# EAGLE design CatNip (EAGLE 5.11)
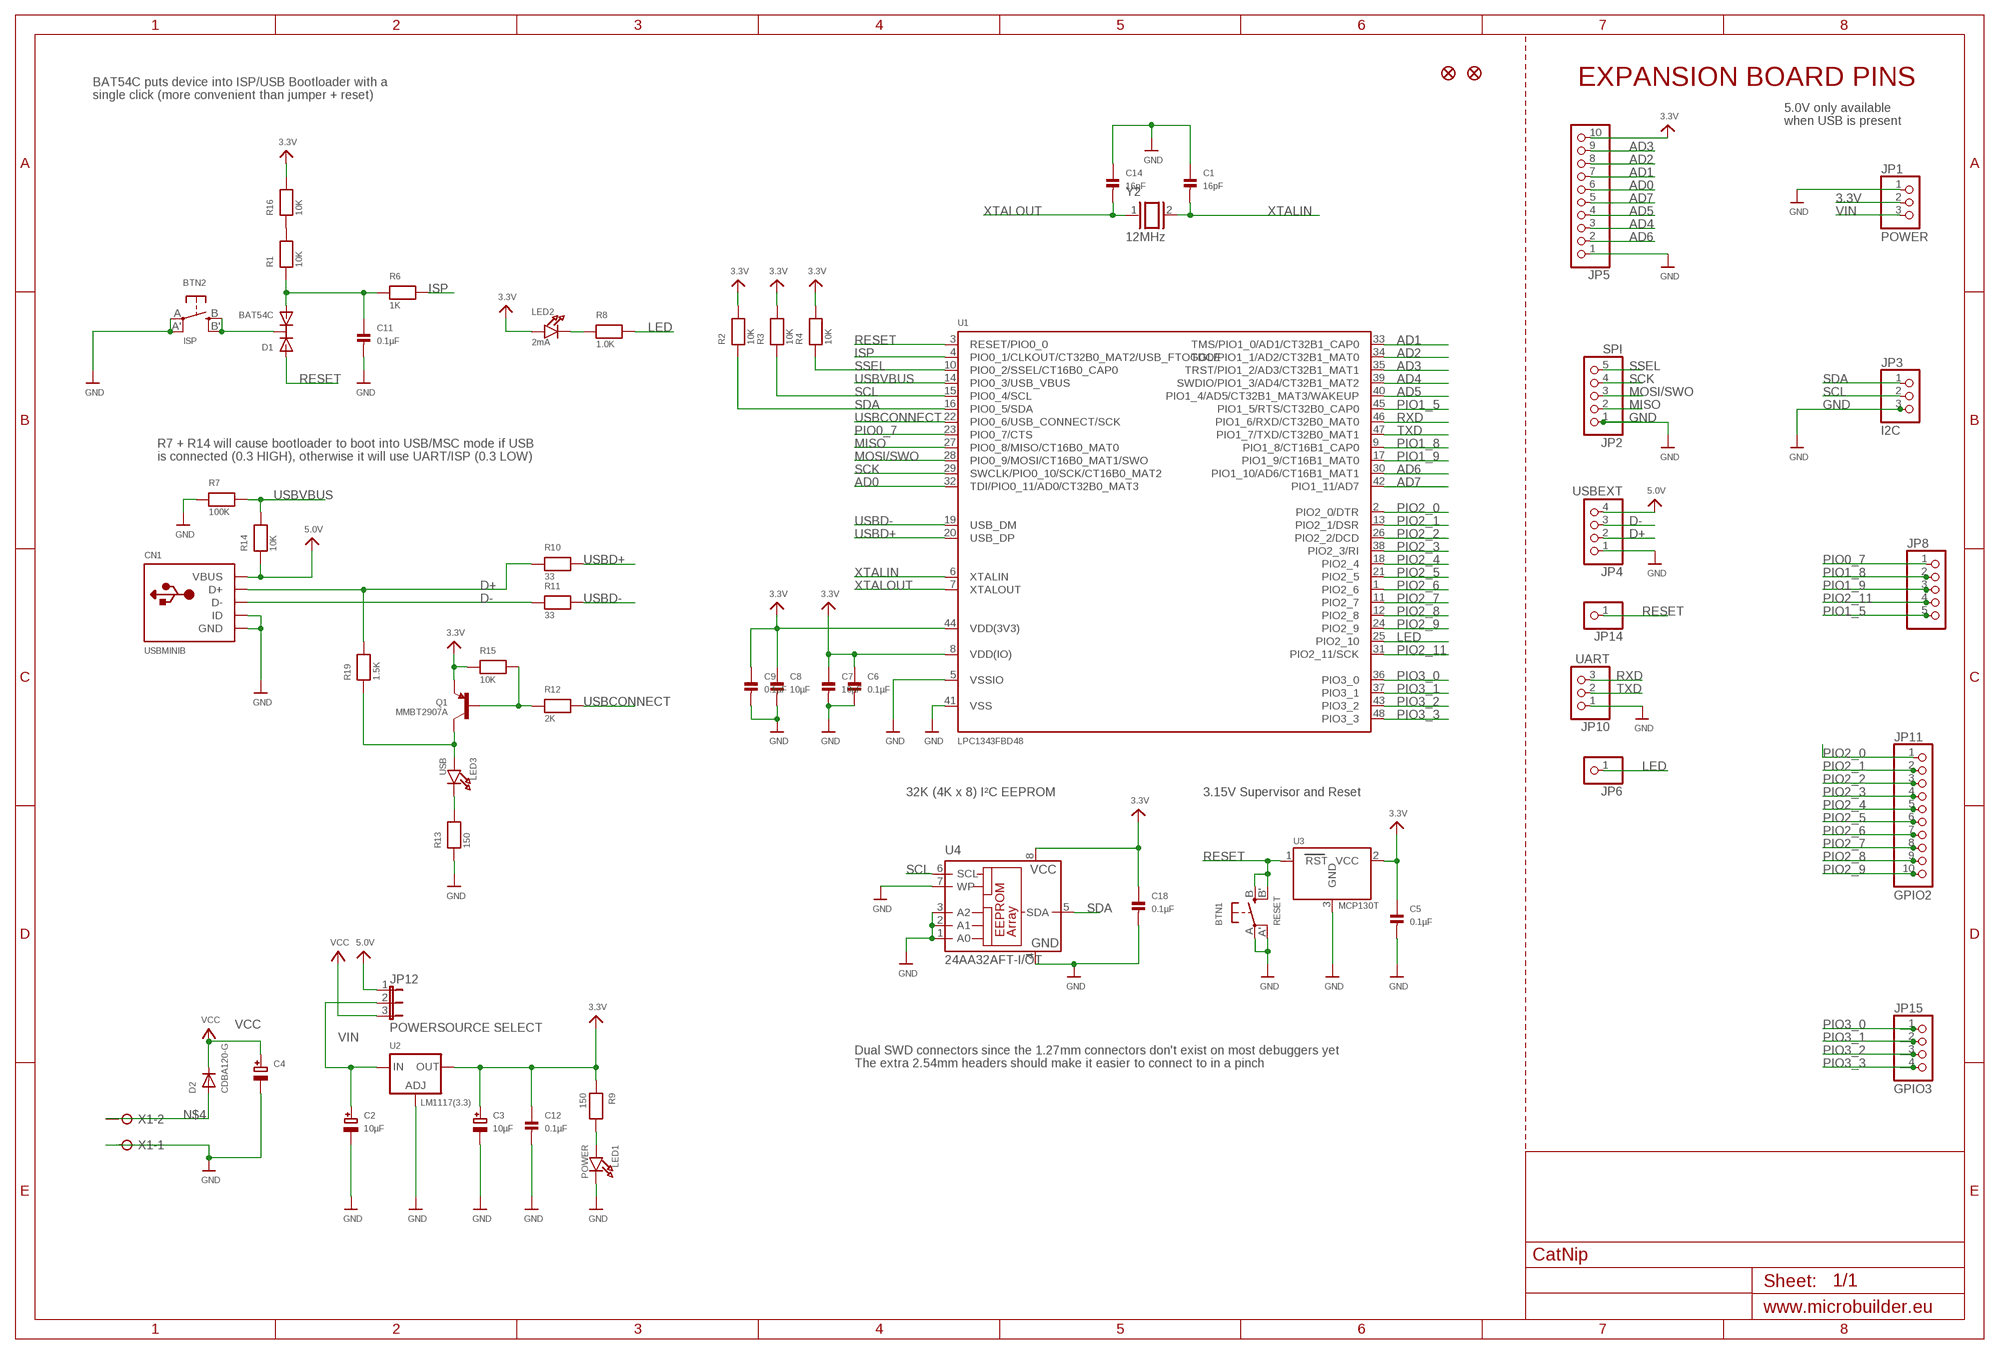
[diagram p0: schematic, sheet 1]

## Parts
BTN1  RESET  BUTTON_SMT  [EVQ-Q2]
BTN2  ISP  BUTTON_SMT  [EVQ-Q2]
C1  16pF  CAP_CERAMIC0603  [0603]
C2  10µF  CAP_TANTALUMA/3216_REFLOW  [EIA3216-18/A-R]
C3  10µF  CAP_TANTALUMA/3216_REFLOW  [EIA3216-18/A-R]
C4  CAP_ELECTROLYTICPANASONIC_C  [PANASONIC_C]
C5  0.1µF  CAP_CERAMIC0603  [0603]
C6  0.1µF  CAP_CERAMIC0603  [0603]
C7  10µF  CAP_CERAMIC0805  [0805]
C8  10µF  CAP_CERAMIC0805  [0805]
C9  0.1µF  CAP_CERAMIC0603  [0603]
C11  0.1µF  CAP_CERAMIC0603  [0603]
C12  0.1µF  CAP_CERAMIC0603  [0603]
C14  16pF  CAP_CERAMIC0603  [0603]
C18  0.1µF  CAP_CERAMIC0603  [0603]
CN1  USBMINIB  [USB-MINIB]
D1  BAT54C  [SOT23-R]
D2  CDBA120-G  DIODESMA  [SMADIODE]
JP1  POWER  HEADER-1X3  [1X03_OVAL]
JP2  SPI  HEADER-1X5  [1X05_OVAL]
JP3  I2C  HEADER-1X3  [1X03_OVAL]
JP4  USBEXT  HEADER-1X4  [1X04_OVAL]
JP5  HEADER-1X10  [1X10_OVAL]
JP6  HEADER-1X1  [1X01_OVAL]
JP7  FIDUCIAL1X2.5  [FIDUCIAL-1X2.5]
JP8  HEADER-1X5  [1X05_OVAL]
JP9  FIDUCIAL1X2.5  [FIDUCIAL-1X2.5]
JP10  UART  HEADER-1X3  [1X03_OVAL]
JP11  GPIO2  HEADER-1X10  [1X10_OVAL]
JP12  POWERSOURCE SELECT  JUMPER3  [JUMPER3]
JP14  HEADER-1X1  [1X01_OVAL]
JP15  GPIO3  HEADER-1X4  [1X04_OVAL]
LED1  POWER  LED0805  [CHIPLED_0805]
LED2  2mA  LED0805  [CHIPLED_0805]
LED3  USB  LED0805  [CHIPLED_0805]
Q1  MMBT2907A  TRANSISTOR_PNPSOT23-REFLOW  [SOT23-R]
R1  10K  RESISTOR0603  [0603]
R2  10K  RESISTOR0603  [0603]
R3  10K  RESISTOR0603  [0603]
R4  10K  RESISTOR0603  [0603]
R6  1K  RESISTOR0603  [0603]
R7  100K  RESISTOR0603  [0603]
R8  1.0K  RESISTOR0603  [0603]
R9  150  RESISTOR0603  [0603]
R10  33  RESISTOR0603  [0603]
R11  33  RESISTOR0603  [0603]
R12  2K  RESISTOR0603  [0603]
R13  150  RESISTOR0603  [0603]
R14  10K  RESISTOR0603  [0603]
R15  10K  RESISTOR0603  [0603]
R16  10K  RESISTOR0603  [0603]
R19  1.5K  RESISTOR0603  [0603]
U1  LPC1343FBD48  LPC1343_QFP  [LQFP48]
U2  LM1117(3.3)  LM1117SOT223-REFLOW  [SOT223-R]
U3  MCP130T  MCP130TREFLOW  [SOT23-R]
U4  24AA32AFT-I/OT  24C32ASN  [SO-08]
X1  W237-02P  [W237-132]
Y2  12MHz  XTAL/S  [QS]

## Nets
3.3V: C3.+ C5.1 C6.1 C7.1 C8.1 C9.1 C12.1 C18.1 JP1.2 JP5.10 LED2.A Q1.2(E) R2.2 R3.2 R4.2 R9.1 R15.1 R16.2 U1.8(VDD(IO)) U1.44(VDD(3V3)) U2.2(OUT) U3.2(VCC) U4.8(VCC)
5.0V: CN1.VBUS JP4.4 JP12.1 R14.1
AD0: JP5.6 U1.32(TDI/PIO0_11/AD0/CT32B0_MAT3)
AD1: JP5.7 U1.33(TMS/PIO1_0/AD1/CT32B1_CAP0)
AD2: JP5.8 U1.34(TDO/PIO1_1/AD2/CT32B1_MAT0)
AD3: JP5.9 U1.35(TRST/PIO1_2/AD3/CT32B1_MAT1)
AD4: JP5.3 U1.39(SWDIO/PIO1_3/AD4/CT32B1_MAT2)
AD5: JP5.4 U1.40(PIO1_4/AD5/CT32B1_MAT3/WAKEUP)
AD6: JP5.2 U1.30(PIO1_10/AD6/CT16B1_MAT1)
AD7: JP5.5 U1.42(PIO1_11/AD7)
D+: CN1.D+ JP4.2 R10.1 R19.2
D-: CN1.D- JP4.3 R11.1
GND: BTN1.A'(P1) BTN1.A(P) BTN2.A'(P1) BTN2.A(P) C1.1 C2.- C3.- C4.- C5.2 C6.2 C7.2 C8.2 C9.2 C11.2 C12.2 C14.1 C18.2 CN1.GND CN1.ID JP1.1 JP2.1 JP3.3 JP4.1 JP5.1 JP10.1 LED1.C R7.1 R13.1 U1.5(VSSIO) U1.41(VSS) U2.1(ADJ) U3.3(GND) U4.1(A0) U4.2(A1) U4.3(A2) U4.4(GND) U4.7(WP) X1.1
ISP: R6.2 U1.4(PIO0_1/CLKOUT/CT32B0_MAT2/USB_FTOGGLE)
LED: JP6.1 R8.2 U1.25(PIO2_10)
MISO: JP2.2 U1.27(PIO0_8/MISO/CT16B0_MAT0)
MOSI/SWO: JP2.3 U1.28(PIO0_9/MOSI/CT16B0_MAT1/SWO)
N$1: LED2.C R8.1
N$3: R1.2 R16.1
N$4: D2.A X1.2
N$5: BTN2.B'(S1) BTN2.B(S) D1.3(C)
N$8: Q1.1(B) R12.1 R15.2
N$9: C11.1 D1.2(A2) R1.1 R6.1
N$10: LED1.A R9.2
N$11: LED3.C R13.2
N$13: LED3.A Q1.3(C) R19.1
PIO0_7: JP8.1 U1.23(PIO0_7/CTS)
PIO1_5: JP8.5 U1.45(PIO1_5/RTS/CT32B0_CAP0)
PIO1_8: JP8.2 U1.9(PIO1_8/CT16B1_CAP0)
PIO1_9: JP8.3 U1.17(PIO1_9/CT16B1_MAT0)
PIO2_0: JP11.1 U1.2(PIO2_0/DTR)
PIO2_1: JP11.2 U1.13(PIO2_1/DSR)
PIO2_2: JP11.3 U1.26(PIO2_2/DCD)
PIO2_3: JP11.4 U1.38(PIO2_3/RI)
PIO2_4: JP11.5 U1.18(PIO2_4)
PIO2_5: JP11.6 U1.21(PIO2_5)
PIO2_6: JP11.7 U1.1(PIO2_6)
PIO2_7: JP11.8 U1.11(PIO2_7)
PIO2_8: JP11.9 U1.12(PIO2_8)
PIO2_9: JP11.10 U1.24(PIO2_9)
PIO2_11: JP8.4 U1.31(PIO2_11/SCK)
PIO3_0: JP15.1 U1.36(PIO3_0)
PIO3_1: JP15.2 U1.37(PIO3_1)
PIO3_2: JP15.3 U1.43(PIO3_2)
PIO3_3: JP15.4 U1.48(PIO3_3)
RESET: BTN1.B'(S1) BTN1.B(S) D1.1(A1) JP14.1 U1.3(RESET/PIO0_0) U3.1(RST)
RXD: JP10.3 U1.46(PIO1_6/RXD/CT32B0_MAT0)
SCK: JP2.4 U1.29(SWCLK/PIO0_10/SCK/CT16B0_MAT2)
SCL: JP3.2 R3.1 U1.15(PIO0_4/SCL) U4.6(SCL)
SDA: JP3.1 R2.1 U1.16(PIO0_5/SDA) U4.5(SDA)
SSEL: JP2.5 R4.1 U1.10(PIO0_2/SSEL/CT16B0_CAP0)
TXD: JP10.2 U1.47(PIO1_7/TXD/CT32B0_MAT1)
USBCONNECT: R12.2 U1.22(PIO0_6/USB_CONNECT/SCK)
USBD+: R10.2 U1.20(USB_DP)
USBD-: R11.2 U1.19(USB_DM)
USBVBUS: R7.2 R14.2 U1.14(PIO0_3/USB_VBUS)
VCC: C4.+ D2.C JP12.3
VIN: C2.+ JP1.3 JP12.2 U2.3(IN)
XTALIN: C1.2 U1.6(XTALIN) Y2.2
XTALOUT: C14.2 U1.7(XTALOUT) Y2.1

## Notes on the sheet
- BAT54C puts device into ISP/USB Bootloader with a | EXPANSION BOARD PINS
- single click (more convenient than jumper + reset)
- 5.0V only available
- when USB is present
- R7 + R14 will cause bootloader to boot into USB/MSC mode if USB
- is connected (0.3 HIGH), otherwise it will use UART/ISP (0.3 LOW)
- 32K (4K x 8) I²C EEPROM | 3.15V Supervisor and Reset
- Dual SWD connectors since the 1.27mm connectors don't exist on most debuggers yet
- The extra 2.54mm headers should make it easier to connect to in a pinch

## Library data of the parts
BTN1 BTN2 = microbuilder:BUTTON_SMT: SMT Push Button (6mm) Digikey: P12940SCT-ND
C1 C5-C9 C11 C12 C14 C18 = microbuilder:CAP_CERAMIC: Ceramic Capacitors 0402 - 0402 Surface Mount Capacitors 16pF 50V 5% [Digikey: 445-4899-2-ND] 18pF 50V 5% [Digikey: 490-1281-2-ND] 22pF 50V 5% [Digikey: 490-1283-2-ND] 68pF 50V 5% [Digikey: 490-1289-2-ND] 0.1uF 10V 10% [Digikey: 490-1318-2-ND] 0603 - 0603 Surface Mount Capacitors 16 pF 50V 5% [Digikey: 445-5051-2-ND] 22 pF 50V [Digikey: PCC220ACVTR-ND] 33 pF 50V 5% [Digikey: 490-1415-1-ND] 56pF 50V 5% [Digikey: 490-1421-1-ND] 220pF 50V 5% [Digikey: 445-1285-1-ND] 680 pF 50V 2200 pF 50V 5% C0G [Digikey: 445-1297-1-ND] 5600 pF 100V 5% X7R [Digikey: 478-3711-1-ND] 0.1 µF 25V 10% [Digikey: PCC2277TR-ND] 0.22 µF 16V 10% X7R [Digikey: 445-1318-1-ND] 1.0 µF 25V 10% [Digikey: 445-5146-2-ND] 0603 - RF Specific 3pF 250V +/-0.1pF RF [Digikey: 712-1347-1-ND] 18 pF 250V 5% [Digikey: 478-3505-1-ND or 712-1322-1-ND] 56 pF 250V 5% C0G RF [Digikey: 490-4867-1-ND] 68 pF 250V RF [Digikey: 490-4868-1-ND] 0805 - 0805 Surface Mount Capacitors 220 pF 250V 2% RF Ceramic Capacitor [Digikey: 712-1398-1-ND] 1000 pF 50V 2% NP0 Ceramic Capacitor [Digikey: 478-3760-1-ND] 0.1 µF 25V 10% Ceramic Capacitor [Digikey: PCC1828TR-ND] 1.0 µF 16V 10% Ceramic Capacitor[Digikey: 490-1691-2-ND] 10.0 µF 10V 10% Ceramic Capacitor[Digikey: 709-1228-1-ND] 47 uF 6.3V 20% Ceramic Capacitor [Digikey: 399-5506-1-ND] 1206 - 1206 Surface Mount Capacitors 47uF 10V 20% Ceramic Capacitor [Digikey: 399-5508-1-ND]
C2 C3 = microbuilder:CAP_TANTALUM: Tantalum Capacitors Wave footprints have larger pads and are meant to be used for hand soldering. Reflow footprints are optimised for solder paste and a reflow oven. EIA3216-18/A-[R/W] - Size A / 3216-18 / 1206 footprint 4.7µF 25V 10% Tantalum Capacitor 10µF 16V 10% Tantalum Capacitor [Digikey: 495-2236-2-ND] EIA3528-21/B-[R/W] - Size B / 3528-21 47µF 10V 10% Tantalum Capactior [Digikey: 495-2216-1-ND] EIA6032-28/C-[R/W] - Size C / 6032-28 10µF 35V 20% Tantalum Capacitor [Digikey: 495-2285-1-ND] 100µF 16V 10% Tantalum Capactior [Digikey: 399-5214-1-ND]
C4 = microbuilder:CAP_ELECTROLYTIC: Electrolytic Capacitors PANASONIC_C - Size C Panasonic Electrolytic Aluminum Capacitor 47µF 16V 20% Electrolytic Capacitor [Digikey: PCE3890TR-ND] PANASONIC_D - Size D Panasonic Electrolytic Aluminum Capacitor 100µF 25V 20% Electrolytic Capacitor [Digikey: PCE3898TR-ND]
CN1 = microbuilder:USB: USB Connectors USBMINIB - Surface Mount Female Mini-B USB Connector 4UConnector: 06564
D1 = microbuilder:BAT54C: BAT54C Schottky Diodes (Common Cathode) 30V 200mA, SOT-23 Package Digikey: BAT54CFSCT-ND
D2 = microbuilder:DIODE: Diode SMADIODE - SMA Surface Mount Package 20V 1A Schottky Diode Digikey (500mV @ 1A, 500uA Vr @ 20V): 641-1014-6-ND SOD-123 30V 500mA (430mV Vf, 130uA Vr @ 30V) Schottky Diode - Digikey: B0530W-FDICT-ND SOD-323 10V 570mA (380mV Vf, 3ns) Schottky Diode - Digikey: ZLLS410CT-ND 1N4148WS - 75V 150mA (1V Vf @ 10mA, 4ns) Simple Diode - Digikey: 1N4148WSFSCT-ND, Mouser: 512-1N4148WS SOD-523 30V 30mA Schottky Diode (RB751S-40TE61) - Digikey: RB751S-40TE61CT-ND SOT23-R/W - SOT23 Package (R = Solder Paste/Reflow Ovens, W = Hand-Soldering) BAT54Film 40V 300mA - Digikey: 497-7162-1-ND DO-1N4148 Through Hole Small Current Diode (any model)
JP1 JP3 JP10 = microbuilder:HEADER-1X3: PIN HEADER
JP2 JP8 = microbuilder:HEADER-1X5: PIN HEADER
JP4 JP15 = microbuilder:HEADER-1X4: PIN HEADER
JP5 JP11 = microbuilder:HEADER-1X10: PIN HEADER
JP6 JP14 = microbuilder:HEADER-1X1: PIN HEADER
JP7 JP9 = microbuilder:FIDUCIAL: Fiducial Alignment Points Various fiducial points for machine vision alignment.
JP12 = microbuilder:JUMPER3: JUMPER - 3 Pins
LED1-LED3 = microbuilder:LED: LED 0603 - 0603 Surface Mount Package Green LED - Low Power (3.9mcd, 2ma, 1.7Vf) Orange LED - Low Power (9.8mcd, 2ma, 1.8Vf) Red LED - Low Power (5mcd, 2ma, 1.8Vf) Yellow LED - Low Power (7mcd, 2ma, 1.8Vf) 0805 - 0805 Surface Mount Package 20mA: Red LED (104mcd, 20mA, Diffused) - LS R976 [Digikey: 475-1278-6-ND] Red LED (12mcd, 20mA, 2.0Vf, Clear) - APT2012EC [Digikey: 754-1128-1-ND] Green LED (15mcd, 20mA, 2.2Vf, Clear) - APT2012GC [Digikey: 754-1131-1-ND] Orange LED (160mcd, 20mA, 2.1Vf, Clear) - APT2012SECK [Digikey: 754-1130-1-ND] 2mA: Red LED (8.8mcd, 2mA, 1.8Vf, Clear) - Low Power [Digikey: 475-2510-1-ND] Green LED (5mcd, 2mA, 1.8Vf, Clear) - Low Power [Digikey: 475-2730-1-ND] Yellow LED (11.3mcd, 2mA, 1.8Vf, Clear) - Low Power [Digikey: 475-2555-1-ND] 1206 - 1206 Surface Mount Package Green LED (26mcd, 20mA, Diffused) - LG N971 [Digikey: 475-1407-6-ND] Red LED (15mcd, 20mA, Diffused) - LH N974 [Digikey: 475-1416-6-ND]
Q1 = microbuilder:TRANSISTOR_PNP: PNP Transistor Transistor (PNP) 800mA 60V [Digikey: MMBT2907AFSTR-ND] SOT23-R - SOT23 footprint optimised for use with solder paste and reflow ovens. SOT23-W - SOT23 footprint optimised for hand-soldering (larger pads).
R1-R4 R6-R16 R19 = microbuilder:RESISTOR: Resistors 0402 - 0402 Surface Mount Package 22 Ohm 1% 1/16W [Digikey: 311-22.0LRTR-ND] 10.0K 1% 1/16W [Digikey: 311-10.0KLRTR-ND] 10.0K 5% 1/16W [Digikey: RMCF0402JT10K0TR-ND] 12.1K 1% 1/16W [Digikey: 311-22.0LRTR-ND] 0603 - 0603 Surface Mount Package 0 Ohm 1/10 Watt 1% Resistor 15 Ohm 1/10 Watt 1% Resistor 33 Ohm 1/10 Watt 1% Resistor 49.9 Ohm 1/10 Watt 1% Resistor 100 Ohm 1/10 Watt 1% Resistor 150 Ohm 1/10 Watt 1% Resistor 240 Ohm 1/10 Watt 1% Resistor 390 Ohm 1/10 Watt 1% Resistor 560 Ohm 1/10 Watt 1% Resistor 750 Ohm 1/10 Watt 1% Resistor 1.0K Ohm 1/10 Watt 1% Resistor 1.5K Ohm 1/10 Watt 1% Resistor 2.0K Ohm 1/10 Watt 1% Resistor 4.7K Ohm 1/10 Watt 1% Resistor 10.0K Ohm 1/10 Watt 1% Resistor 20.0K Ohm 1/10 Watt 1% Resistor 33.0K Ohm 1/10 Watt 1% Resistor 100.0K Ohm 1/10 Watt 1% Resistor 0805 - 0805 Surface Mount Package 0 Ohm 1/8 Watt 1% Resistor 33 Ohm 1/8 Watt 1% Resistor 100 Ohm 1/8 Watt 1% Resistor 150 Ohm 1/8 Watt 1% Resistor 200 Ohm 1/8 Watt 1% Resistor 240 Ohm 1/8 Watt 1% Resistor 330 Ohm 1/8 Watt 1% Resistor 390 Ohm 1/8 Watt 1% Resistor 470 Ohm 1/8 Watt 1% Resistor 1.0K Ohm 1/8 Watt 1% Resistor 1.5K Ohm 1/8 Watt 1% Resistor 2.0K Ohm 1/8 Watt 1% Resistor 4.7K Ohm 1/8 Watt 1% Resistor 5.1K Ohm 1/8 Watt 1% Resistor 5.6K Ohm 1/8 Watt 1% Resistor 10.0K Ohm 1/8 Watt 1% Resistor 22.0K Ohm 1/8 Watt 1% Resistor 33.0K Ohm 1/8 Watt 1% Resistor 100K Ohm 1/8 Watt 1% Resistor 1206 - 1206 Surface Mount Package
U1 = microbuilder:LPC1343_QFP: LPC1343 72 MHz 32-bit ARM Cortex-M3 microcontroller. 32 kB Flash, 8 kB SRAM, USB Device Mouser: 771-LPC1343FBD48151 Digikey: 568-4945-ND
U2 = microbuilder:LM1117: LM1117 Voltage Regulator LM1117 Adjustable Voltage regulator [Digikey: LM1117IMP-ADJDKR-ND] LM1117 3.3V Voltage regulator [AP1117E33GDIDKR-ND] LM1117 5.0V Voltage regulator [AP1117E50GDIDKR-ND] SOT223-REFLOW - SOT223 package for solder paste/reflow ovens SOT223-WAVE - SOT223 package for hand-soldering (larger pads) Note: For the fixed-voltage regulators, simply set the ADJ pin to GND.
U3 = microbuilder:MCP130T: MCP130T Voltage Supervisor (Active Low) Voltage supervisors will put the MCU in a reset state if the voltage drops below a pre-determined level. SOT23-R/SOT23-W: Voltage Supervisor - 3.15V Active Low Note: Use the "Reflow" footprint when working with solder paste, and the "Wave" footprint when soldering by hand with a soldering iron (the latter has larger pads that are easier to solder by hand). Digikey: MCP130T-315I/TTCT-ND
U4 = microchip:24*: Serial EEPROM I2C; MPN: IS24C32A-2GLI; OC_FARNELL: 1224413; OC_NEWARK: 43M4588
X1 = con-wago-508:W237-02P: WAGO SREW CLAMP; OC_FARNELL: unknown; OC_NEWARK: unknown
Y2 = special:XTAL/S: CRYSTAL

## Board
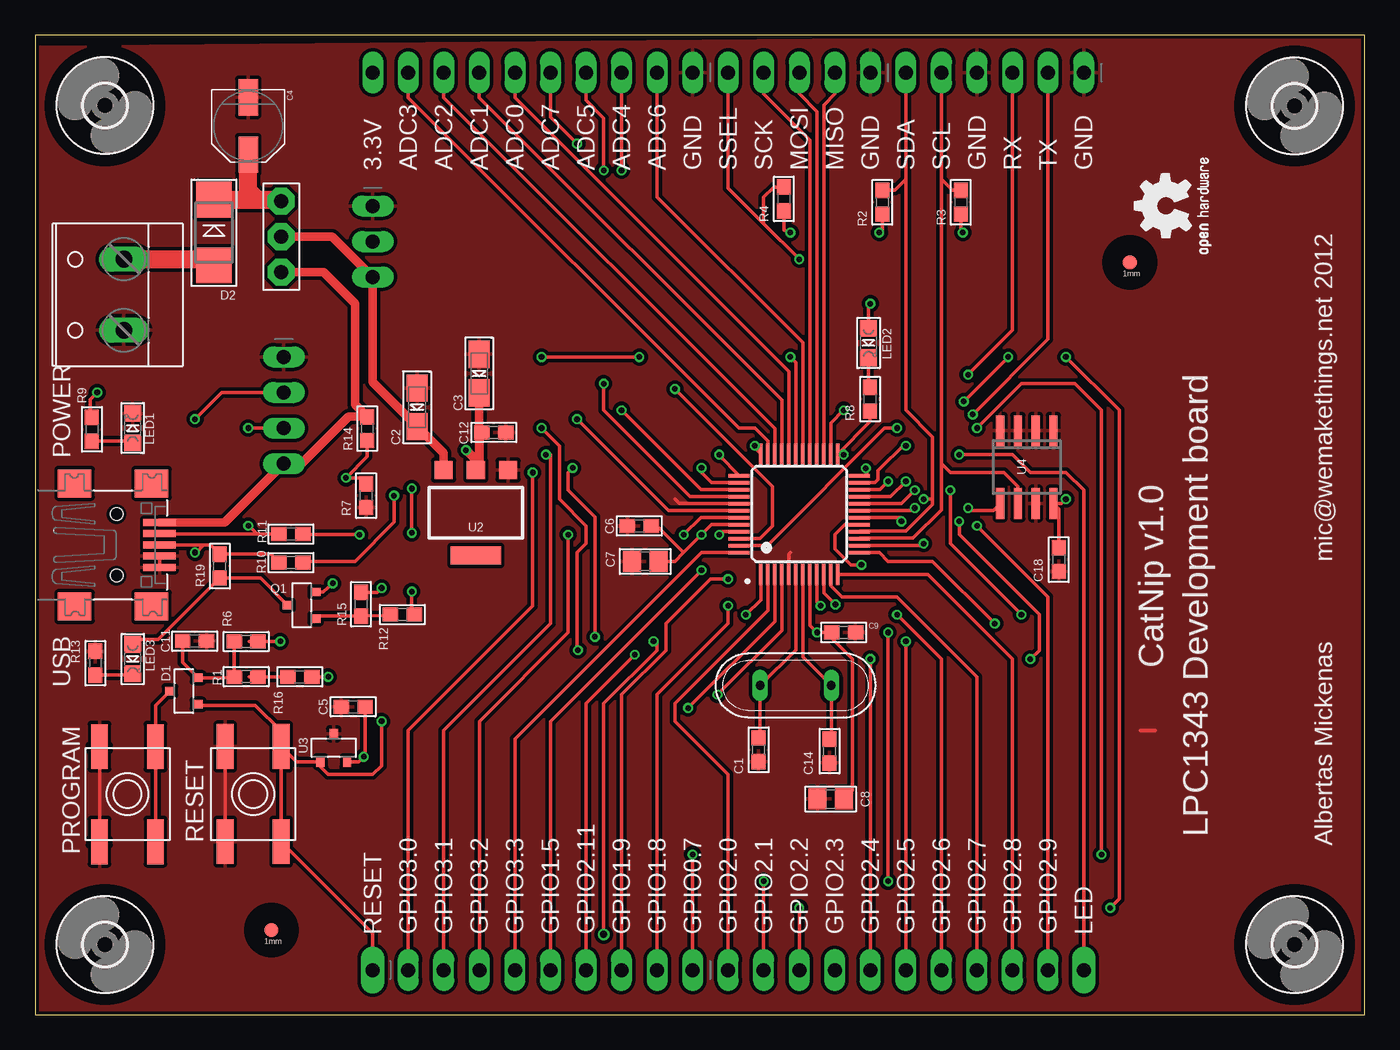
[diagram p1: board, top side]
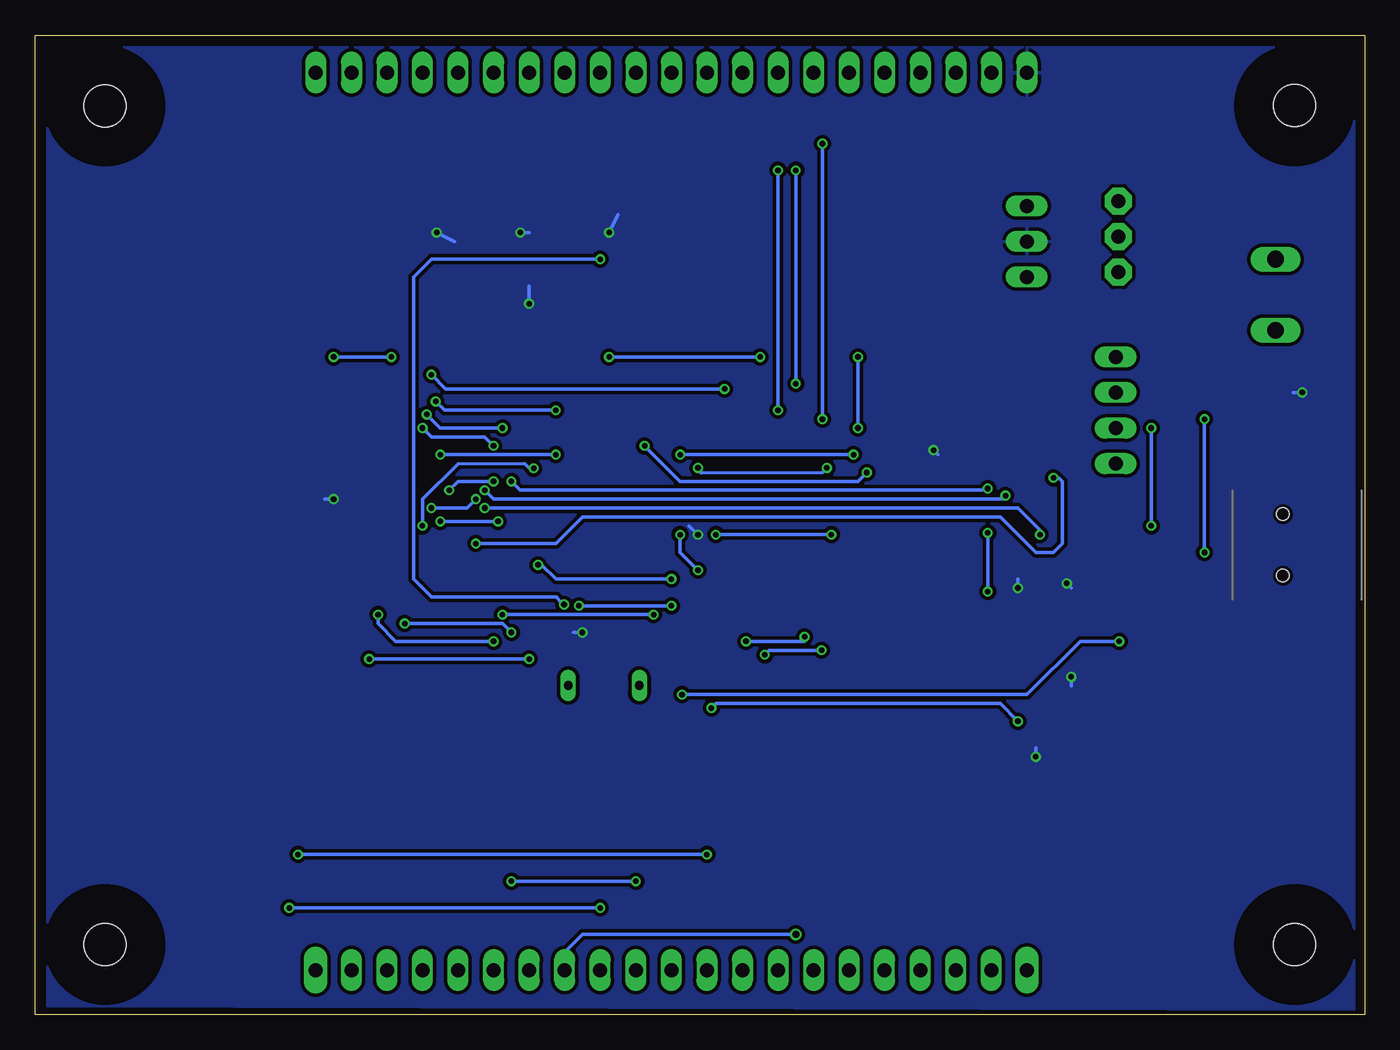
[diagram p2: board, bottom side, seen from below]

Size 95 x 70 mm. Coordinates in mm from the lower left corner, seen from the top.
Outline: 95,0 95,70 0,70 0,0 95,0
Copper layers (1*16): Top 0.035mm / dielectric 1.5mm / Bottom 0.035mm
Design rules "Fusion_eagle_rule_v1.1": minimum track width 6mil, minimum drill 12mil, track to track 6mil, track to pad 6mil, pad to pad 6mil, via to via 6mil, smd to smd 0mil, copper to edge 10mil, drill to drill 10mil, minimum pad ring 10mil, minimum via ring 6mil, stop-mask expansion 2mil, vias tented up to drill 100mil, thermal gap 10mil
tRestrict: area 3.9,12.1 to 3.9,12.5; area 5.3,12.1 to 5.3,12.5; area 3.9,18.8 to 3.9,19.3; area 5.3,18.8 to 5.3,19.3

### Footprints (pad centres in the part's own frame; a part is rotated, then mirrored left to right if it is on the bottom)
EVQ-Q2 = smd 3.2 x 1.2: A -3.4,-2; A' 3.4,-2; B -3.4,2; B' 3.4,2
0603 = smd 1.1 x 1: 1 -0.85,0; 2 0.85,0
EIA3216-18/A-R = smd 1.95 x 1.5: + 1.375,0; - -1.375,0
PANASONIC_C = smd 2.6 x 1.4: + 2.05,0; - -2.05,0
0805 = smd 1.3 x 1.5: 1 -0.95,0; 2 0.95,0
USB-MINIB = smd 0.5 x 2.308: D+ 0,4.064; D- -0.8,4.064; GND 1.6,4.064; ID 0.8,4.064; VBUS -1.6,4.064 | smd 2 x 2.4: GND1 -4.4,-2; GND2 -4.4,3.5; GND3 4.4,3.5; GND4 4.4,-2 | hole 0.9: -2.2,1; 2.2,1
SOT23-R = smd 0.6 x 0.7: 1 -0.95,-1; 2 0.95,-1; 3 0,1
SMADIODE = smd 2.54 x 2.54: A 2.349,0; C -2.349,0
1X03_OVAL = drill 1 long: 1 -2.54,0; 2 0,0; 3 2.54,0
1X05_OVAL = drill 1 long: 1 -5.08,0; 2 -2.54,0; 3 0,0; 4 2.54,0; 5 5.08,0
1X04_OVAL = drill 1 long: 1 -3.81,0; 2 -1.27,0; 3 1.27,0; 4 3.81,0
1X10_OVAL = drill 1 long: 1 -11.43,0; 2 -8.89,0; 3 -6.35,0; 4 -3.81,0; 5 -1.27,0; 6 1.27,0; 7 3.81,0; 8 6.35,0; 9 8.89,0; 10 11.43,0
1X01_OVAL = drill 1 pad 1.676 long: 1 0,0
FIDUCIAL-1X2.5 = smd 1 x 1: 1 0,0
JUMPER3 = drill 1 pad 1.93 octagon: 1 -2.54,0; 2 0,0; 3 2.54,0
CHIPLED_0805 = smd 1.2 x 1.2: A 0,-1.05; C 0,1.05
LQFP48 = smd 1.5 x 0.25: 1 -4.3,2.75; 2 -4.3,2.25; 3 -4.3,1.75; 4 -4.3,1.25; 5 -4.3,0.75; 6 -4.3,0.25; 7 -4.3,-0.25; 8 -4.3,-0.75; 9 -4.3,-1.25; 10 -4.3,-1.75; 11 -4.3,-2.25; 12 -4.3,-2.75; 25 4.3,-2.75; 26 4.3,-2.25; 27 4.3,-1.75; 28 4.3,-1.25; 29 4.3,-0.75; 30 4.3,-0.25; 31 4.3,0.25; 32 4.3,0.75; 33 4.3,1.25; 34 4.3,1.75; 35 4.3,2.25; 36 4.3,2.75 | smd 0.25 x 1.5: 13 -2.75,-4.3; 14 -2.25,-4.3; 15 -1.75,-4.3; 16 -1.25,-4.3; 17 -0.75,-4.3; 18 -0.25,-4.3; 19 0.25,-4.3; 20 0.75,-4.3; 21 1.25,-4.3; 22 1.75,-4.3; 23 2.25,-4.3; 24 2.75,-4.3; 37 2.75,4.3; 38 2.25,4.3; 39 1.75,4.3; 40 1.25,4.3; 41 0.75,4.3; 42 0.25,4.3; 43 -0.25,4.3; 44 -0.75,4.3; 45 -1.25,4.3; 46 -1.75,4.3; 47 -2.25,4.3; 48 -2.75,4.3
SOT223-R = smd 1.3 x 1.3: 1 -2.3,-3.05; 2 0,-3.05; 3 2.3,-3.05 | smd 3.6 x 1.3: 4 0,3.05
SO-08 = smd 0.6 x 2.2: 1 -1.905,-2.6; 2 -0.635,-2.6; 3 0.635,-2.6; 4 1.905,-2.6; 5 1.905,2.6; 6 0.635,2.6; 7 -0.635,2.6; 8 -1.905,2.6
MOUNTINGHOLE_3.0 = hole 3: 0,0
W237-132 = drill 1.194 long: 1 -2.54,-0.635; 2 2.54,-0.635
QS = drill 0.61 long: 1 -2.54,0; 2 2.54,0

### Placement (x,y rotation side)
BTN1  15.59,15.75 270 top
BTN2  6.61,15.75 270 top
C1  51.71,18.92 90 top
C2  27.3,43.39 270 top
C3  31.75,45.81 270 top
C4  15.24,63.5 270 top
C5  22.74,21.99 180 top
C6  43.18,34.92 180 top
C7  43.6,32.38 180 top
C8  56.86,15.39 180 top
C9  57.78,27.3 0 top
C11  11.41,26.68 0 top
C12  32.78,41.6 0 top
C14  56.77,18.82 90 top
C18  73.15,32.51 270 top
CN1  4.83,33.56 270 top
D1  10.64,23.12 90 top
D2  12.79,55.88 270 top
JP1  24.13,55.25 270 top
JP2  54.61,67.31 180 top
JP3  64.77,67.31 0 top
JP4  17.78,43.18 270 top
JP5  35.56,67.31 180 top
JP6  74.93,3.17 0 top
JP7  78.23,53.75 0 top
JP8  41.91,3.17 180 top
JP9  16.89,6.04 0 top
JP10  72.39,67.31 180 top
JP11  60.96,3.17 0 top
JP12  17.6,55.59 90 top
JP14  24.13,3.18 0 top
JP15  30.48,3.17 0 top
LED1  6.98,41.91 0 top
LED2  59.56,47.99 180 top
LED3  6.99,25.4 180 top
Q1  19.05,29.25 90 top
R1  15.09,24.14 0 top
R2  60.55,58.04 270 top
R3  66.15,58.04 270 top
R4  53.51,58.29 270 top
R6  15.09,26.65 0 top
R7  23.66,37.08 90 top
R8  59.67,43.98 270 top
R9  4.07,41.81 270 top
R10  18.29,32.3 0 top
R11  18.29,34.33 0 top
R12  26.25,28.58 0 top
R13  4.31,25.11 270 top
R14  23.75,41.87 270 top
R15  23.29,29.32 270 top
R16  18.92,24.13 0 top
R19  13.21,32.04 90 top
U1  54.61,35.76 90 top
U2  31.5,35.85 180 top
U3  21.35,19.06 0 top
U4  70.87,39.12 180 top
U$16  [OSHW2]  85.09,53.98 90 top
U$52  [MOUNTINGHOLE_3.0]  5,5 90 top
U$54  [MOUNTINGHOLE_3.0]  5,64.96 90 top
U$55  [MOUNTINGHOLE_3.0]  90,5 90 top
U$56  [MOUNTINGHOLE_3.0]  90,64.93 90 top
X1  5.71,51.44 90 top
Y2  54.36,23.52 180 top

### Tracks (layer width: path | path; a pad name or v marks a point on that pad's centre or on a via)
3.3V  (via drill 0.4, 0.4 pad 0.25, 0.4 pad 0.3)
  Top 0.254: R16.2 v20.95,24.13 | 31.75,39.15 U2.2 31.93,39.34 | 31.93,39.34 C12.1 | 31.93,39.34 31.79,39.34 | Q1.2 20.6,30.2 v21.28,30.81 | R15.1 24.46,30.17 v24.77,30.48 | U3.2 23.14,18.06 v23.5,18.41 23.59,18.51 C5.1 | R2.2 60.55,56.1 v60.33,55.88 | R4.2 53.51,56.05 v53.98,55.88 | R3.2 66.15,56.02 v66.29,55.88 | LED2.A 59.56,50.67 v59.69,50.8 | U1.8 55.36,27.82 v55.88,27.3 | v73.66,36.83 73.35,36.52 U4.8 73.15,36.14 C18.1 | U1.44 48.35,35.01 v47.62,34.29 | v47.62,34.29 | C7.1 45.72,32.38 46.35,33.02 | 46.35,33.02 v47.62,34.29 | v4.45,44.45 3.93,43.94 3.93,42.8 R9.1 | C6.1 44.45,34.92 46.35,33.02 | v55.88,27.3 C9.1 | v55.88,27.3 56.52,27.3 58.42,25.4 58.42,16.01 C8.1
  Top 0.61: 31.75,39.15 C3.+ | 31.79,39.34 v30.79,40.33
  Bottom 0.254: v30.79,40.33 30.48,40.01 | v21.28,30.81 20.95,30.48 | v24.77,30.48 24.77,31.11 | v20.95,24.13 20.95,23.5 | v23.5,18.41 23.5,19.05 | v4.45,44.45 5.08,44.45 | v60.33,55.88 59.69,55.88 | v53.98,55.88 53.34,57.15 | 65.02,55.24 v66.29,55.88 | v59.69,50.8 59.69,52.07 | v55.88,27.3 56.52,27.3 | v73.66,36.83 74.3,36.83 | v47.62,34.29 48.26,34.92
  pour Bottom (isolate 0.254): 0.76,69.09 94.11,69.09 94.11,0.64 0.76,0.38
5.0V
  Top 0.61: JP12.1 20.61,53.05 22.86,50.8 22.86,43.6 R14.1 22.4,42.72 19.05,39.37 JP4.4 13.57,35.16 CN1.VBUS
AD0
  Top 0.254: U1.32 53.86,45.96 34.29,65.53 JP5.6
AD1
  Top 0.254: U1.33 53.36,43.92 31.75,65.53 JP5.7
AD2
  Top 0.254: U1.34 52.86,41.88 29.21,65.53 JP5.8
AD3
  Top 0.254: U1.35 52.36,40.98 51.44,41.91 50.29,41.91 26.67,65.53 JP5.9
AD4  (via drill 0.4 pad 0.25)
  Top 0.152: 41.91,66.67 JP5.3
  Top 0.254: U1.39 47.58,37.51 v41.91,43.18 | v41.91,60.33 41.91,66.67 41.91,67.06
  Bottom 0.254: v41.91,43.18 v41.91,60.33
AD5  (via drill 0.4 pad 0.25)
  Top 0.254: U1.40 46.81,37.01 40.64,43.18 v40.64,45.09 | v40.64,60.33 40.64,64.07 39.37,65.34 JP5.4
  Bottom 0.254: v40.64,45.09 v40.64,60.33
AD6
  Top 0.254: U1.30 54.86,48.01 44.45,58.42 44.45,67.06 JP5.2
AD7  (via drill 0.4 pad 0.25)
  Top 0.254: U1.42 45.27,36.01 v38.73,42.55 | v38.73,62.23 36.83,64.14 JP5.5
  Bottom 0.254: v38.73,42.55 v38.73,62.23
D+  (via drill 0.4 pad 0.25)
  Top 0.254: CN1.D+ 12.06,33.56 | 12.06,33.56 12.55,33.56 R19.2 16.85,32.89 R10.1 | JP4.2 13.34,44.45 v11.43,42.55 | v11.43,33.02 11.43,32.92 12.06,33.56
  Bottom 0.254: v11.43,33.02 v11.43,42.55
D-  (via drill 0.4 pad 0.25)
  Top 0.254: CN1.D- 8.92,34.33 15.88,34.33 | 15.88,34.33 R11.1 | v15.24,41.91 JP4.3 | v15.24,34.92 15.24,34.97 15.88,34.33
  Bottom 0.254: v15.24,34.92 v15.24,41.91
GND
  Top 0.254: 80.06,20.32 79,20.32 | CN1.ID CN1.GND | BTN2.A' BTN2.A | BTN1.A' BTN1.A | U1.5 53.86,32.91 53.98,33.02 | U1.41 46.04,36.51 45.72,36.83
  pour Top (isolate 0.254): 0,0 0.25,69.11 95,70 95,0
ISP  (via drill 0.4)
  Top 0.254: U1.4 53.36,27.46 v48.77,22.86 | v17.53,26.67 15.32,26.67 R6.2
  Bottom 0.254: v17.53,26.67 20.32,26.67 24.13,22.86 v48.77,22.86
LED  (via drill 0.4 pad 0.3)
  Top 0.254: R8.2 59.67,42.36 U1.25 57.73,40.06 v57.78,40.01 | v66.04,40.01 69.85,40.01 71.12,38.73 73.66,38.73 74.93,37.47 JP6.1
  Bottom 0.254: v66.04,40.01 v57.78,40.01
MISO
  Top 0.254: U1.27 56.36,65 57.15,65.79 JP2.2
MOSI/SWO
  Top 0.254: U1.28 55.86,64.53 54.61,65.79 JP2.3
N$1
  Top 0.254: LED2.C 59.56,44.94 R8.1
N$3
  Top 0.254: R1.2 15.32,24.13 R16.1
N$4
  Top 1.27: X1.2 12.35,53.98 D2.A
N$5
  Top 0.254: BTN2.B' BTN2.B 8.61,22.08 D1.3
N$8
  Top 0.254: Q1.1 20.23,28.47 R15.2 25.07,28.52 R12.1
N$9
  Top 0.254: C11.1 10.56,25.16 D1.2 13.53,24.07 R1.1 R6.1
N$10
  Top 0.254: R9.2 6.88,40.97 LED1.A
N$11
  Top 0.254: R13.2 6.4,24.26 LED3.C
N$13
  Top 0.254: Q1.3 16.11,31.19 R19.1 8.82,26.8 7.33,26.8 LED3.A
PIO0_7  (via drill 0.4 pad 0.3)
  Top 0.254: U1.23 60.03,38.01 60.24,38.21 60.24,38.86 62.18,40.8 62.18,40.69 v62.23,40.64 | JP8.1 v46.99,11.43 | v67.31,41.91 70.48,45.09 74.3,45.09 76.2,43.18 v76.2,11.43
  Bottom 0.254: v46.99,11.43 v76.2,11.43 | v62.23,40.64 62.87,41.27 66.67,41.27 v67.31,41.91
PIO1_5  (via drill 0.4 pad 0.3)
  Top 0.254: U1.45 49.12,34.51 v48.9,34.29 | v47.62,31.75 36.83,20.95 JP8.5
  Bottom 0.254: v48.9,34.29 48.9,33.02 v47.62,31.75
PIO1_8  (via drill 0.4 pad 0.3)
  Top 0.254: v49.53,29.21 49.53,27.94 44.45,22.86 JP8.2 | U1.9 55.86,29.48 v56.13,29.21
  Bottom 0.254: v49.53,29.21 v56.13,29.21
PIO1_9  (via drill 0.4 pad 0.3)
  Top 0.254: U1.17 57.87,35.01 57.15,34.29 57.15,33.27 58.29,32.13 v59.05,32.13 | JP8.3 42.55,3.17 41.91,3.81 41.91,22.86 45.09,26.04 45.09,27.94 48.26,31.11 v49.53,31.11
  Bottom 0.254: v59.05,32.13 58.8,32.13 57.78,31.11 v49.53,31.11
PIO2_0
  Top 0.254: U1.2 52.36,28.87 45.72,22.23 45.72,20.95 49.53,17.14 JP11.1
PIO2_1  (via drill 0.4 pad 0.3)
  Top 0.254: U1.13 60.33,33.01 60.96,32.38 64.14,32.38 v68.58,27.94 | v60.96,9.53 v60.96,27.3 | JP11.2 v52.07,9.53
  Bottom 0.254: v68.58,27.94 61.59,27.94 v60.96,27.3 | v52.07,9.53 v60.96,9.53
PIO2_2  (via drill 0.4 pad 0.3)
  Top 0.254: U1.26 56.86,42.26 v57.78,43.18 | v69.54,46.99 v66.36,43.81 | v73.66,46.99 77.47,43.18 77.47,8.26 v76.83,7.62 | JP11.3 v54.61,7.62
  Bottom 0.254: v57.78,43.18 65.73,43.18 v66.36,43.81 | v73.66,46.99 v69.54,46.99 | v54.61,7.62 v76.83,7.62
PIO2_3  (via drill 0.4 pad 0.3, 0.5 pad 0.3)
  Top 0.254: U1.38 48.35,38.01 47.62,38.73 v47.62,39.06 | v38.42,39.06 38.1,38.73 38.1,37.47 40.01,35.56 v40.01,26.99 | v44.2,26.67 44.45,26.67 44.45,26.04 40.64,22.23 v40.64,5.71
  Bottom 0.254: v38.42,39.06 38.42,39.05 38.73,38.73 47.42,38.71 47.62,38.91 v47.62,39.06 | v44.2,26.67 40.01,26.67 v40.01,26.99 | v40.64,5.71 55.88,5.71 57.15,4.45 JP11.4
PIO2_4  (via drill 0.4 pad 0.3)
  Top 0.254: U1.18 61.86,35.51 v61.91,35.24 | v66.04,35.24 66.04,34.29 71.75,28.57 71.75,26.04 v71.12,25.4 | JP11.5 v59.69,25.4
  Bottom 0.254: v66.04,35.24 v61.91,35.24 | v59.69,25.4 v71.12,25.4
PIO2_5  (via drill 0.4 pad 0.3)
  Top 0.254: U1.21 61.14,37.01 v62.23,38.1 | v65.41,37.47 65.41,33.66 v70.48,28.57 | JP11.6 v62.23,26.67
  Bottom 0.254: v65.41,37.47 64.77,38.1 v62.23,38.1 | v62.23,26.67 69.22,26.67 70.48,27.94 v70.48,28.57
PIO2_6  (via drill 0.4 pad 0.3)
  Top 0.254: U1.1 51.86,29.64 v50.8,28.57 | v61.59,28.57 64.77,25.4 JP11.7
  Bottom 0.254: v61.59,28.57 v50.8,28.57
PIO2_7
  Top 0.254: U1.11 56.86,30.64 57.66,29.84 61.59,29.84 67.31,24.13 JP11.8
PIO2_8
  Top 0.254: U1.12 63.79,31.46 69.85,25.4 JP11.9
PIO2_9  (via drill 0.4 pad 0.3)
  Top 0.254: v67.31,34.92 72.39,29.84 JP11.10 | U1.24 59.48,38.51 v59.37,39.03
  Bottom 0.254: v59.37,39.03 59.66,39.03 60,39.37 64.78,39.35 67.31,36.83 v67.31,34.92
PIO2_11  (via drill 0.4 pad 0.3)
  Top 0.254: U1.31 54.36,46.6 v53.98,46.99 | v36.2,46.99 v43.18,46.99 | 39.05,26.11 v38.79,26.04 38.73,26.09 38.73,33.02 39.37,33.66 39.37,34.92 37.47,36.83 37.47,40.64 v36.2,41.91 | v42.86,25.71 39.37,22.23 JP8.4
  Bottom 0.254: v43.18,46.99 v53.98,46.99 | v36.2,41.91 v36.2,46.99 | v42.86,25.71 42.86,25.72 42.55,26.04 v38.79,26.04
PIO3_0  (via drill 0.4 pad 0.3)
  Top 0.254: U1.36 51.44,40.49 v51.44,40.64 | v35.56,38.73 35.56,29.21 26.67,20.32 JP15.1
  Bottom 0.254: v51.44,40.64 48.9,38.1 36.2,38.1 v35.56,38.73
PIO3_1  (via drill 0.4 pad 0.3)
  Top 0.254: U1.37 48.9,39.93 v48.9,40.01 | v36.51,40.01 36.83,40.01 36.83,27.94 29.21,20.32 JP15.2
  Bottom 0.254: v36.51,40.01 v48.9,40.01
PIO3_2  (via drill 0.4 pad 0.3)
  Top 0.254: JP15.3 31.75,20.95 38.1,27.3 v38.1,34.29 | U1.43 47.58,35.51 v46.35,34.29
  Bottom 0.254: v38.1,34.29 v46.35,34.29
PIO3_3
  Top 0.254: U1.48 47.62,33.01 34.29,19.68 JP15.4
RESET  (via drill 0.4 pad 0.25)
  Top 0.254: BTN1.B BTN1.B' 24.13,5.81 JP14.1 | BTN1.B 17.59,20.26 15.75,22.1 11.71,22.1 D1.1 | BTN1.B 18.68,18.06 U3.1 20.4,17.7 20.95,17.14 24.13,17.14 24.77,17.78 v24.77,20.95 | U1.3 52.86,28.1 v46.67,21.9
  Bottom 0.254: v46.67,21.9 46.67,21.91 46.35,22.23 26.04,22.23 v24.77,20.95
RXD  (via drill 0.4 pad 0.25)
  Top 0.254: U1.46 51.79,34.01 52.7,34.92 52.7,37.72 v45.72,44.7 | v66.67,45.72 69.85,48.9 JP10.3
  Bottom 0.254: v45.72,44.7 65.66,44.7 v66.67,45.72
SCK
  Top 0.254: U1.29 55.36,62.49 52.07,65.79 JP2.4
SCL
  Top 0.254: U1.15 58.94,34.04 62.74,34.04 64.77,36.07 64.77,39.37 | 64.77,39.37 64.77,59.69 | 64.77,59.69 JP3.2 | R3.1 65.57,58.89 64.77,59.69 | U4.6 70.23,37.72 69.22,38.73 65.41,38.73 64.77,39.37
SDA  (via drill 0.4, 0.4 pad 0.25)
  Top 0.254: U1.16 58.95,34.54 62.23,34.54 64.14,36.45 64.14,36.83 | 64.14,36.83 64.14,41.27 62.23,43.18 62.23,59.69 | 62.23,59.69 JP3.1 | 64.14,36.83 v63.5,36.83 | v66.67,36.2 66.84,36.03 68.47,36.03 U4.5 | R2.1 61.43,58.89 62.23,59.69
  Bottom 0.254: v66.67,36.2 64.14,36.2 v63.5,36.83
SSEL  (via drill 0.4 pad 0.25)
  Top 0.254: JP2.5 49.53,59.05 52.07,56.52 | v54.61,53.98 52.07,56.52 | R4.1 52.79,59.14 52.07,58.42 52.07,56.52 | U1.10 56.36,30.14 v57.2,29.3
  Bottom 0.254: v54.61,53.98 66.67,53.98 67.94,52.7 67.94,31.11 66.67,29.84 57.73,29.84 57.22,29.2 v57.2,29.3
TXD  (via drill 0.4 pad 0.25)
  Top 0.254: U1.47 50.33,33.53 52.32,33.53 60.71,41.91 v61.59,41.91 | v67.01,42.88 72.39,48.26 JP10.2
  Bottom 0.254: v61.59,41.91 66.04,41.91 v67.01,42.88
USBCONNECT  (via drill 0.4 pad 0.25)
  Top 0.254: U1.22 60.37,37.51 v60.96,38.1 | v26.92,34.42 v26.92,37.59 | v26.92,30.23 26.92,28.75 R12.2
  Bottom 0.254: v60.96,38.1 60.33,37.47 27.05,37.47 v26.92,37.59 | v26.92,30.23 v26.92,34.42
USBD+  (via drill 0.4 pad 0.25)
  Top 0.254: U1.20 61.91,36.51 v62.87,37.47 | v25.65,37.08 25.65,35.18 22.86,32.38 19.23,32.38 R10.2
  Bottom 0.254: v62.87,37.47 62.23,36.83 25.91,36.83 v25.65,37.08
USBD-  (via drill 0.4, 0.4 pad 0.25)
  Top 0.254: U1.19 62.68,36.01 v62.87,36.2 | v23.18,34.29 19.18,34.29 R11.2
  Bottom 0.254: v62.87,36.2 24.77,36.2 23.18,34.61 v23.18,34.29
USBVBUS  (via drill 0.4, 0.4 pad 0.25)
  Top 0.254: U1.14 63.36,33.51 v63.5,33.66 | R14.2 23.75,39.87 v22.23,38.35 23.24,38.35 R7.2
  Bottom 0.254: v63.5,33.66 57.78,33.66 55.88,35.56 26.04,35.56 23.5,33.02 22.23,33.02 21.59,33.66 21.59,38.1 21.84,38.35 v22.23,38.35
VCC
  Top 0.254: JP12.3
  Top 1.27: D2.C 15.88,58.23 | 15.88,58.23 17.49,58.23 JP12.3 | C4.+ 15.24,58.87 15.88,58.23
VIN
  Top 0.61: U2.3 29.2,40.12 C2.+ 24.13,45.19 JP1.3 | JP1.3 | JP12.2 21.25,55.59 JP1.3
XTALIN
  Top 0.254: U1.6 54.36,26.06 Y2.2 51.82,19.71 C1.2
XTALOUT
  Top 0.254: U1.7 54.86,25.55 Y2.1 56.9,19.32 C14.2

### Text on the board
tPlace: 3.3V | ADC3 | ADC2 | ADC1 | ADC0 | ADC7 | ADC5 | ADC4 | ADC6 | GND | SSEL | SCK | MOSI | MISO | GND | SDA | SCL | GND | RX | TX | GND | POWER | mic@wemakethings.net 2012 | CatNip v1.0 | USB | PROGRAM | RESET | LPC1343 Development board | Albertas Mickenas | RESET | GPIO3.0 | GPIO3.1 | GPIO3.2 | GPIO3.3 | GPIO1.5 | GPIO2.11 | GPIO1.9 | GPIO1.8 | GPIO0.7 | GPIO2.0 | GPIO2.1 | GPIO2.2 | GPIO2.3 | GPIO2.4 | GPIO2.5 | GPIO2.6 | GPIO2.7 | GPIO2.8 | GPIO2.9 | LED